# EasyEDA schematic SCH_Pico-Greenhouse-PCB_2026-05-26(1).json
TITLE: Greenhouse-Pico; REV: 2.2; Date: 2026-05-22; Sheet: 1/1; Drawn By: hiroyugane
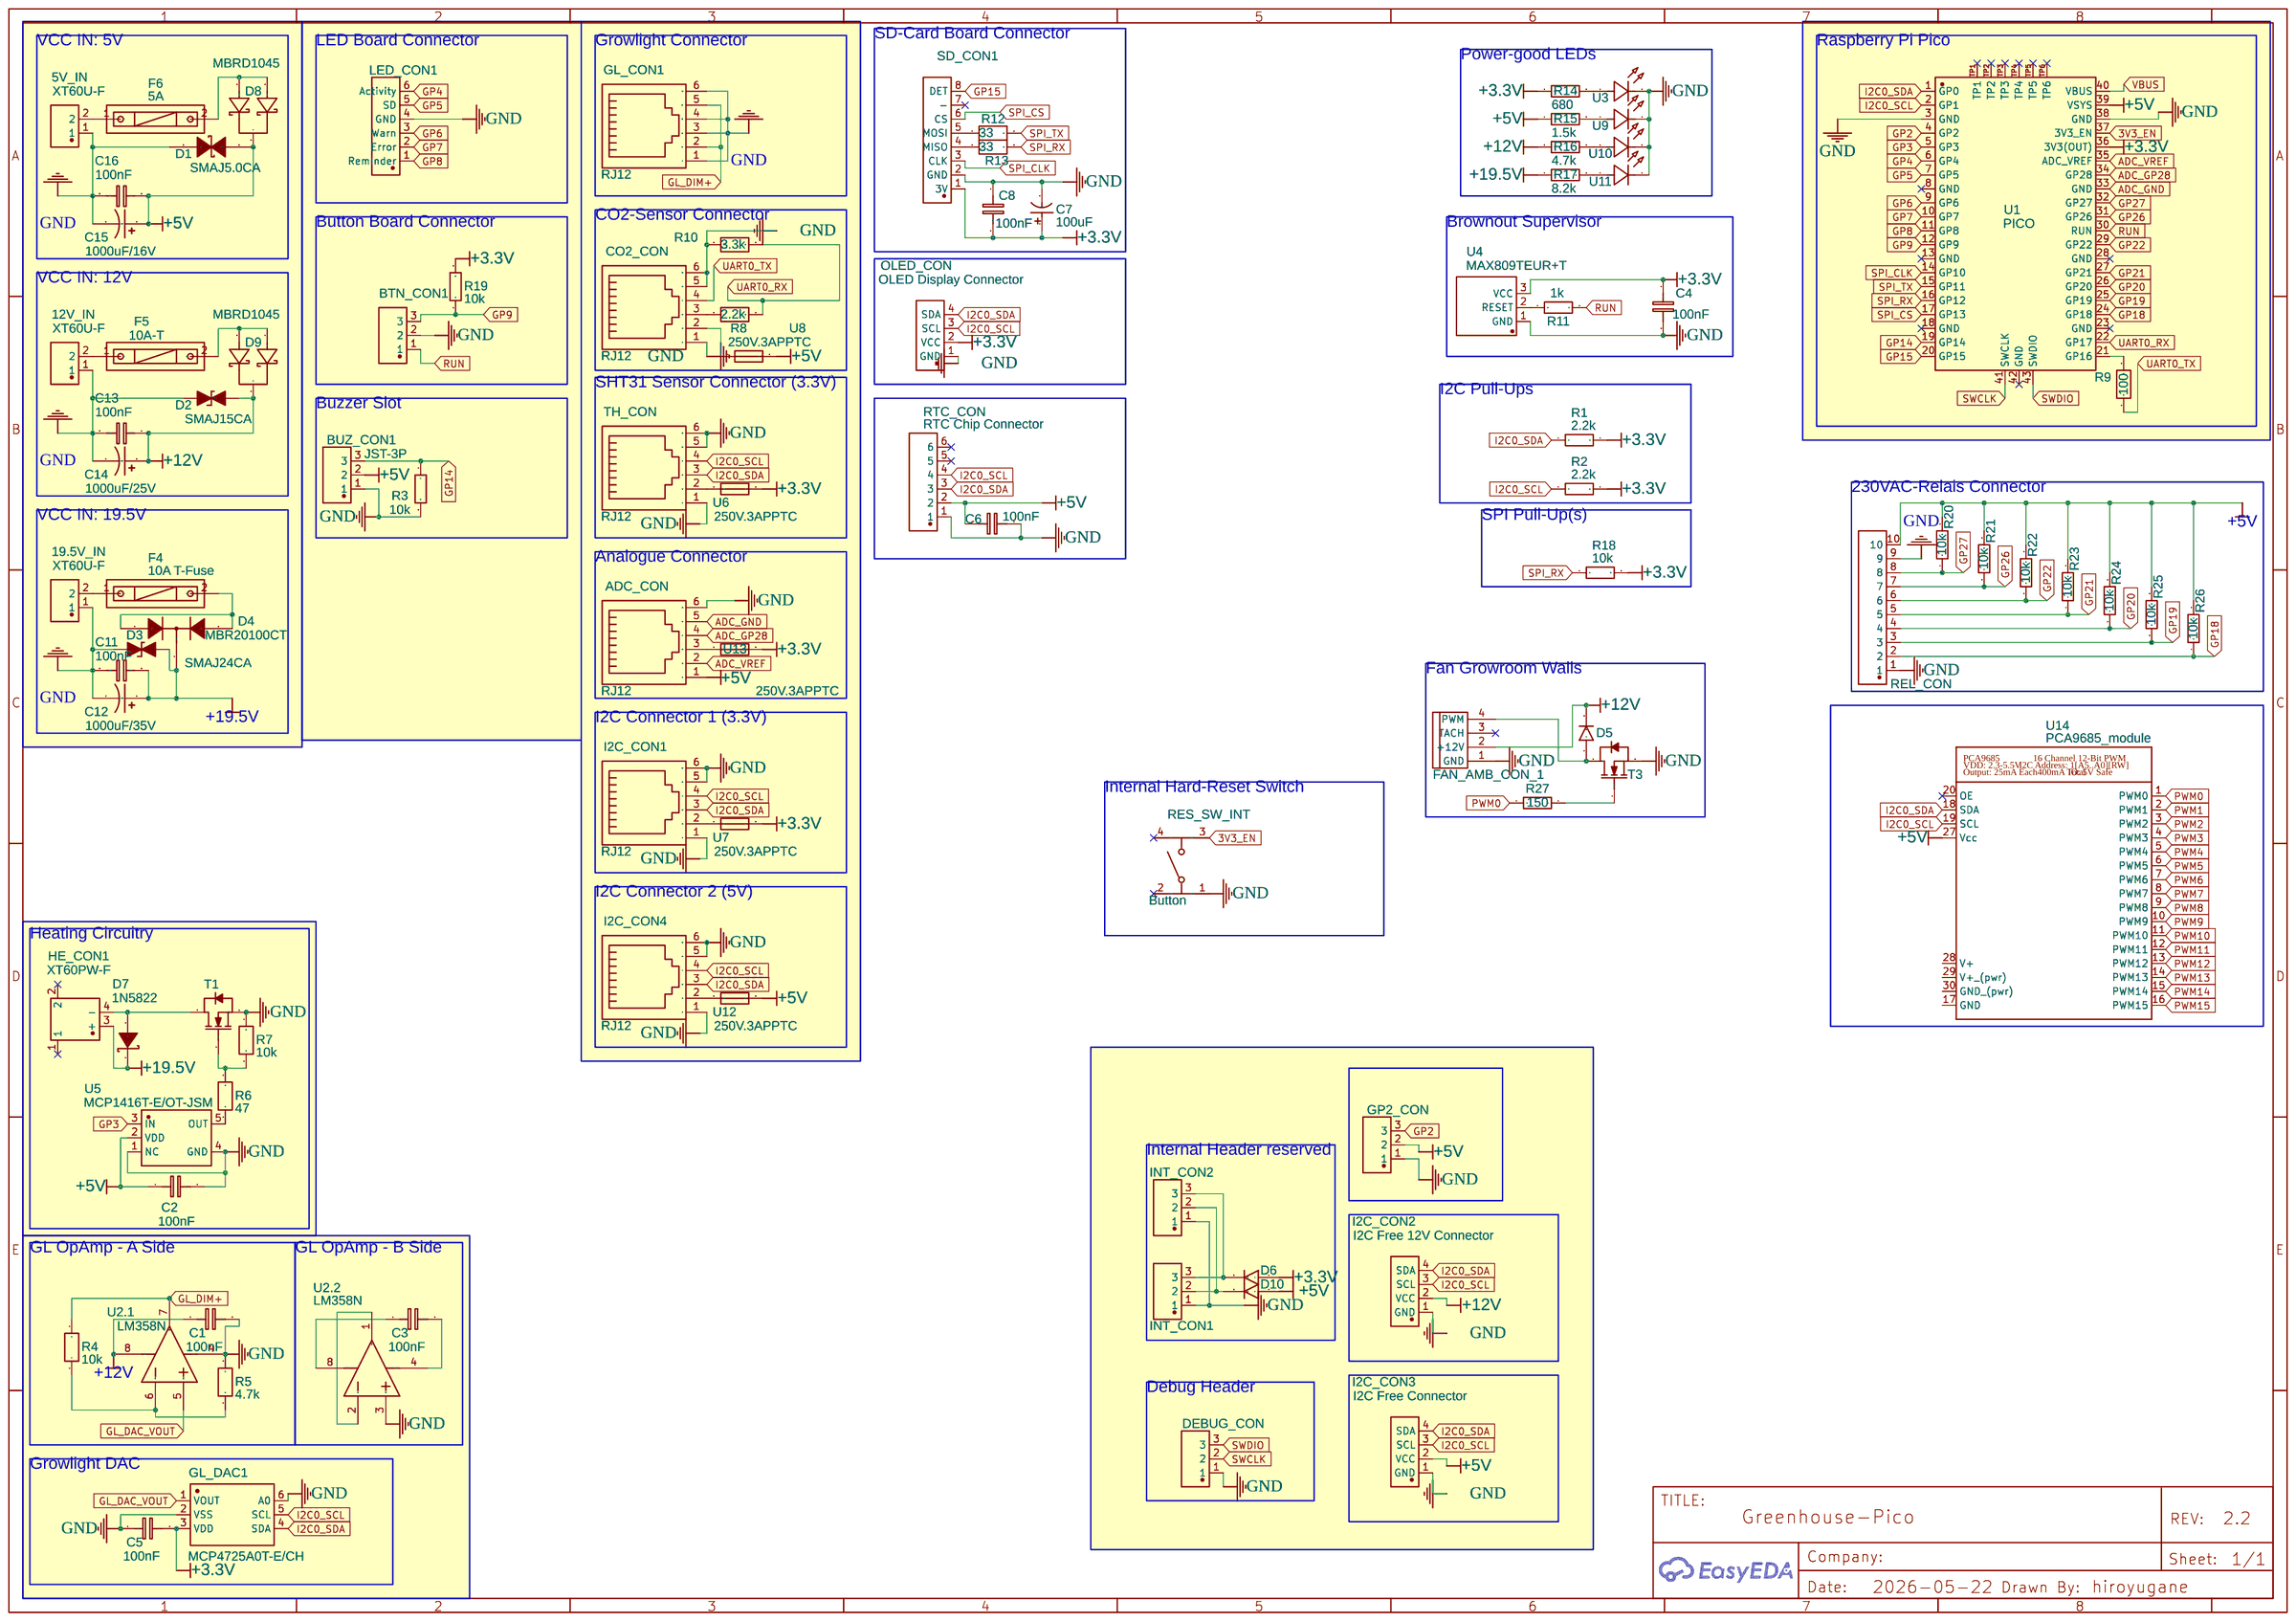
[diagram p0: schematic sheet]

## Parts
5V_IN  XT60U-F  [CONN-TH_XT60U-F]
12V_IN  XT60U-F  [CONN-TH_XT60U-F]
19.5V_IN  XT60U-F  [CONN-TH_XT60U-F]
ADC_CON  RJ12  [RJ12-TH_95501-2661]
BTN_CON1  Reset / Menu Button  [BUZ_CON]
BUZ_CON1  JST-3P  [BUZ_CON]
C1  100nF  [CONDENSATOR-SMALL]
C2  100nF  [CONDENSATOR-SMALL]
C3  100nF  [CONDENSATOR-SMALL]
C4  100nF  [CONDENSATOR-SMALL]
C5  100nF  [CONDENSATOR-SMALL]
C6  100nF  [CONDENSATOR-SMALL]
C7  100uF  [CAP-TH_BD5.0-P2.00-D0.8-FD]
C8  100nF  [CONDENSATOR-SMALL]
C11  100nF  [CONDENSATOR-SMALL]
C12  1000uF/35V  [CAP-TH_BD12.5-P5.00-D0.8-FD]
C13  100nF  [CONDENSATOR-SMALL]
C14  1000uF/25V  [CAP-TH_BD12.5-P5.00-D0.8-FD]
C15  1000uF/16V  [CAP-TH_BD12.5-P5.00-D0.8-FD]
C16  100nF  [CONDENSATOR-SMALL]
CO2_CON  RJ12  [RJ12-TH_95501-2661]
D1  SMAJ5.0CA  [SMA_L4.4-W2.6-LS5.0-BI]
D2  SMAJ15CA  [SMA_L4.4-W2.6-LS5.0-BI]
D3  SMAJ24CA  [SMA_L4.4-W2.6-LS5.0-BI]
D4  MBR20100CT  [TO-220-3_L10.0-W4.5-P2.54-L]
D5  UF4007_C84067  [DO-41_BD2.4-L4.7-P8.70-D0.9-FD]
D6  UF4007_C84067  [DO-41_BD2.4-L4.7-P8.70-D0.9-FD]
D7  1N5822  [DO-201AD_BD5.3-L8.4-P12.50-D1.4-FD]
D8  MBRD1045  [TO-252-3_L6.5-W5.9-P4.60-LS10.0-BL]
D9  MBRD1045  [TO-252-3_L6.5-W5.9-P4.60-LS10.0-BL]
D10  UF4007_C84067  [DO-41_BD2.4-L4.7-P8.70-D0.9-FD]
DEBUG_CON  B3B-XH-A-BK(LF)(SN)  [CONN-TH_3P-P2.50_B3B-XH-A-BK-LF-SN]
F4  10A T-Fuse  [FUSE-TH_L22.6-W9.0]
F5  10A-T  [FUSE-TH_L22.6-W9.0]
F6  5A  [FUSE-TH_L22.6-W9.0]
FAN_AMB_CON_1  XH2.54-4AW  [CONN-TH_XH2.54-4AW]
GL_CON1  RJ12  [RJ12-TH_95501-2661]
GL_DAC1  MCP4725A0T-E/CH  [SOT-23-6_L2.9-W1.6-P0.95-LS2.8-BL]
GP2_CON  GP2 Reserved  [CONN-TH_3P-P2.50_B3B-XH-A-BK-LF-SN]
HE_CON1  XT60PW-F  [TH_2P-XT60PW-F]
I2C_CON1  RJ12  [RJ12-TH_95501-2661]
I2C_CON2  I2C Free 12V Connector  [CONN-TH_4P-P2.50_JST_B4B-XH-A-M]
I2C_CON3  I2C Free Connector  [CONN-TH_4P-P2.50_JST_B4B-XH-A-M]
I2C_CON4  RJ12  [RJ12-TH_95501-2661]
INT_CON1  GP2 Reserved  [CONN-TH_3P-P2.50_B3B-XH-A-BK-LF-SN]
INT_CON2  GP2 Reserved  [CONN-TH_3P-P2.50_B3B-XH-A-BK-LF-SN]
LED_CON1  Led-PCB-Connector  [CONN-TH_6P-P2.50_JST_B6B-EH-LF-SN]
OLED_CON  OLED Display Connector  [CONN-TH_4P-P2.50_JST_B4B-XH-A-M]
R1  2.2k  [RES-TH_BD2.3-L6.5-P6.9-D0.5]
R2  2.2k  [RES-TH_BD2.3-L6.5-P6.9-D0.5]
R3  10k  [RES-TH_BD2.3-L6.5-P6.9-D0.5]
R4  10k  [R_TH]
R5  4.7k  [R_TH]
R6  47  [R_TH]
R7  10k  [R_TH]
R8  2.2k  [R_TH]
R9  100  [R_TH]
R10  3.3k  [R_TH]
R11  1k  [RES-TH_BD2.3-L6.5-P6.9-D0.5]
R12  33  [R_TH]
R13  33  [R_TH]
R14  680  [RES-TH_BD2.3-L6.5-P6.9-D0.5]
R15  1.5k  [RES-TH_BD2.3-L6.5-P6.9-D0.5]
R16  4.7k  [RES-TH_BD2.3-L6.5-P6.9-D0.5]
R17  8.2k  [RES-TH_BD2.3-L6.5-P6.9-D0.5]
R18  10k  [RES-TH_BD2.3-L6.5-P6.9-D0.5]
R19  10k  [RES-TH_BD2.3-L6.5-P6.9-D0.5]
R20  10k  [RES-TH_BD2.3-L6.5-P6.9-D0.5]
R21  10k  [RES-TH_BD2.3-L6.5-P6.9-D0.5]
R22  10k  [RES-TH_BD2.3-L6.5-P6.9-D0.5]
R23  10k  [RES-TH_BD2.3-L6.5-P6.9-D0.5]
R24  10k  [RES-TH_BD2.3-L6.5-P6.9-D0.5]
R25  10k  [RES-TH_BD2.3-L6.5-P6.9-D0.5]
R26  10k  [RES-TH_BD2.3-L6.5-P6.9-D0.5]
R27  150  [RES-TH_BD2.3-L6.5-P6.9-D0.5]
REL_CON  CONN-TH-10P  [CONN-TH_10P-P2.50_JST_B10B-EH]
RES_SW_INT  Button  [SW-TH_4P-L6.0-W6.0-P4.50-LS6.1]
RTC_CON  RTC Chip Connector  [RTC-CHIP FOOTPRINT]
SD_CON1  Adafruit SD Con  [CONN-TH_8P-P2.50-XH2.54-8P]
T1  IRLZ44NPBF-VB  [TO-220-3_L10.0-W4.5-P2.54-L-2]
T3  IRLZ44NPBF-VB  [TO-220-3_L10.0-W4.5-P2.54-L-2]
TH_CON  RJ12  [RJ12-TH_95501-2661]
U1  PICO  [RPI-PICO-V2]
U2  LM358N  [PDIP-8_L10.2-W5.9-P2.54-LS7.6-BL]  (sections 1,2)
U3  3RC  [LED-TH_BD3.0-2P-P2.50]
U4  MAX809TEUR+T  [SOT-23-3_L2.9-W1.6-P1.90-LS2.8-BR]
U5  MCP1416T-E/OT-JSM  [SOT-23-5_L3.0-W1.6-P0.95-LS2.8-BR]
U6  250V.3APPTC  [FUSE-TH_L11.4-W3.0-P5.10-D0.8-S1.20]
U7  250V.3APPTC  [FUSE-TH_L11.4-W3.0-P5.10-D0.8-S1.20]
U8  250V.3APPTC  [FUSE-TH_L11.4-W3.0-P5.10-D0.8-S1.20]
U9  3RC  [LED-TH_BD3.0-2P-P2.50]
U10  3RC  [LED-TH_BD3.0-2P-P2.50]
U11  3RC  [LED-TH_BD3.0-2P-P2.50]
U12  250V.3APPTC  [FUSE-TH_L11.4-W3.0-P5.10-D0.8-S1.20]
U13  250V.3APPTC  [FUSE-TH_L11.4-W3.0-P5.10-D0.8-S1.20]
U14  PCA9685_module  [PCA9685]

## Library data of the parts
5V_IN 12V_IN 19.5V_IN = XT60U-F: Supplier: LCSC; Supplier Part: C19191801; Manufacturer: AMASS(艾迈斯); JLCPCB Part Class: Extended Part; Contributor: lcsc
ADC_CON CO2_CON GL_CON1 I2C_CON1 I2C_CON4 TH_CON = 95501-2661: Contributor: LCSC; Supplier: LCSC; Supplier Part: C240856; Manufacturer: MOLEX; Manufacturer Part: 955012661; JLCPCB Part Class: Extended Part
BTN_CON1 BUZ_CON1 DEBUG_CON GP2_CON INT_CON1 INT_CON2 = B3B-XH-A-BK(LF)(SN): Contributor: LCSC; Supplier: LCSC; Supplier Part: C493416; Manufacturer: JST; JLCPCB Part Class: Extended Part
C1-C6 C8 C11 C13 C16 = C_0603_EU: Contributor: LCEDA_Lib
C7 = 100uf/10V: Supplier: LCSC; Manufacturer: Chengx(承兴); Manufacturer Part: KM107M010D11RR0VH2FP0; Supplier Part: C2035; JLCPCB Part Class: Extended Part
C12 C14 C15 = 50ZLJ1000M12.5X30: Contributor: lcsc; Supplier: LCSC; Supplier Part: C5115376; Manufacturer: rubycon(红宝石)
D1 = SMAJ5.0CA_C143136: Contributor: LCSC; Supplier Part: C143136; Supplier: LCSC; Manufacturer: FMS(美丽微); JLCPCB Part Class: Extended Part
D2 = SMAJ15CA: Supplier: LCSC; Manufacturer: RUILON(瑞隆源); Supplier Part: C46985; JLCPCB Part Class: Extended Part
D3 = SMAJ24CA: Supplier: LCSC; Manufacturer: RUILON(瑞隆源); Supplier Part: C28092; JLCPCB Part Class: Extended Part
D4 = MBR20100CT: Supplier: LCSC; Manufacturer: CJ(江苏长电/长晶); Supplier Part: C98706; JLCPCB Part Class: Extended Part
D5 D6 D10 = UF4007_C84067: Contributor: 立创EDA官方封装库; Supplier: LCSC; Manufacturer: 星海; Manufacturer Part: UF4007; Supplier Part: C84067; JLCPCB Part Class: Extended Part
D7 = 1N5822: Supplier: LCSC; Manufacturer: MDD(辰达半导体); Supplier Part: C2476; JLCPCB Part Class: Extended Part
D8 D9 = MBRD1045: Supplier: LCSC; Supplier Part: C5137764; Manufacturer: GOODWORK(固得沃克); JLCPCB Part Class: Extended Part; Contributor: lcsc
F4-F6 = 5x20 BLX-Atype Fuse holder XC-7: Supplier: LCSC; Manufacturer Part: 5x20 BLX-A型 保险丝支架 XC-7; Manufacturer: xcfuse(旭程); Supplier Part: C3131; JLCPCB Part Class: Extended Part
FAN_AMB_CON_1 = XH2.54-4AW: Supplier: LCSC; Manufacturer: BOOMELE(博穆精密); Manufacturer Part: XH-4AW; Supplier Part: C21273; JLCPCB Part Class: Extended Part
GL_DAC1 = MCP4725A0T-E/CH: Contributor: LCSC; Supplier: LCSC; Manufacturer: MICROCHIP(美国微芯); Supplier Part: C144198; JLCPCB Part Class: Extended Part
HE_CON1 = XT60PW-F_C428722: Supplier: LCSC; Supplier Part: C428722; Manufacturer: AMASS(艾迈斯); JLCPCB Part Class: Extended Part; Contributor: lcsc
I2C_CON2 I2C_CON3 OLED_CON = B4B-XH-A-R(LF)(SN): Contributor: lcsc; Supplier: LCSC; Supplier Part: C595709; Manufacturer: JST; JLCPCB Part Class: Extended Part
LED_CON1 = B6B-EH(LF)(SN): Contributor: LCSC; Supplier: LCSC; Supplier Part: C493147; Manufacturer: JST; JLCPCB Part Class: Extended Part
R1-R3 R11 R14-R27 = 330Ω (331) ±5%: Contributor: LCSC; Supplier: LCSC; Supplier Part: C10322; Manufacturer: Made in China; JLCPCB Part Class: Extended Part
R4-R10 R12 R13 = R_0603_EU: Contributor: LCEDA_Lib
REL_CON = B10B-EH(LF)(SN): Contributor: lcsc; Supplier: LCSC; Supplier Part: C265062; Manufacturer: JST; JLCPCB Part Class: Extended Part
RES_SW_INT = Button-6x6x6mm: Supplier Part: C71836; Supplier: LCSC; Manufacturer: BBJ; Manufacturer Part: Switch,6*6*6Plastic head,260G, 0.25mm,Straight line
RTC_CON = ZX-PM2.54-1-6PY: Supplier: LCSC; Supplier Part: C7499326; Manufacturer: Megastar(兆星); Contributor: lcsc; JLCPCB Part Class: Extended Part
SD_CON1 = HDGC2501WV-8P: Supplier: LCSC; Supplier Part: C5175254; Manufacturer: HDGC(华德共创); JLCPCB Part Class: Extended Part; Contributor: lcsc
T1 T3 = IRLZ44NPBF-VB: Supplier: LCSC; Supplier Part: C20755022; Manufacturer: VBsemi(微碧半导体); JLCPCB Part Class: Extended Part; Contributor: lcsc
U1 = PICO: Supplier: LCSC; Supplier Part: C7203002; Manufacturer: Raspberry Pi(树莓派); Contributor: lcsc; JLCPCB Part Class: Extended Part
U2 = LM358N: subpart_no: 1; Supplier: LCSC; Supplier Part: C83405; Manufacturer: TI(德州仪器); Manufacturer Part: LM358N/NOPB; JLCPCB Part Class: Extended Part
U3 U9-U11 = 3RC: Supplier: LCSC; Supplier Part: C19479802; Manufacturer: BIVAR; JLCPCB Part Class: Extended Part; Contributor: lcsc
U4 = MAX809TEUR+T: Supplier: LCSC; Manufacturer: ADI(亚德诺)/MAXIM(美信); Supplier Part: C16711; JLCPCB Part Class: Extended Part
U5 = MCP1416T-E/OT-JSM: Supplier: LCSC; Supplier Part: C18195002; Manufacturer: JSMSEMI(杰盛微); Contributor: lcsc; JLCPCB Part Class: Extended Part
U6-U8 U12 U13 = 30V3APPTC: Contributor: lcsc; Supplier: LCSC; Supplier Part: C9900014925; Manufacturer: null; JLCPCB Part Class: Extended Part
U14 = PCA9685_module: Contributor: Quentin Chatenet

## Nets
3V3_EN: RES_SW_INT.3 U1.37(3V3_EN)
+3.3V: C4.1 C5.2 C7.1 C8.2 D6.1(A) GL_DAC1.3(VDD) OLED_CON.2(VCC) R1.2 R2.2 R14.1 R18.2 R19.2 SD_CON1.1(3V) U1.36(3V3(OUT)) U4.3(VCC) U6.2 U7.2 U13.2
+5V: ADC_CON.1 BUZ_CON1.2 C2.1 C6.1 C15.1 C16.1 D1.1 D8.2(K) D10.1(A) GP2_CON.2 I2C_CON3.2(VCC) R15.1 R20.2 R21.2 R22.2 R23.2 R24.2 R25.2 R26.2 REL_CON.10 RTC_CON.2 U1.39(VSYS) U5.2(VDD) U8.2 U12.2 U14.27(Vcc)
+12V: C1.1 C13.1 C14.1 D2.1(K) D5.2(C) D9.2(K) FAN_AMB_CON_1.2(+12V) I2C_CON2.2(VCC) R16.1
+19.5V: C11.1 C12.1 D3.1(K) D4.2(C) D7.2(K) HE_CON1.3(+) R17.1
GND: 5V_IN.1 12V_IN.1 19.5V_IN.1 ADC_CON.6 BTN_CON1.2 BUZ_CON1.1 C1.2 C2.2 C4.2 C5.1 C6.2 C7.2 C8.1 C11.2 C12.2 C13.2 C14.2 C15.2 C16.2 CO2_CON.1 CO2_CON.5 CO2_CON.6 D1.2 D2.2(A) D3.2(A) DEBUG_CON.1 FAN_AMB_CON_1.1(GND) GL_CON1.1 GL_CON1.3(GL-) GL_CON1.4(GL-) GL_CON1.6 GL_DAC1.2(VSS) GL_DAC1.6(A0) GP2_CON.1 I2C_CON1.1 I2C_CON1.5 I2C_CON1.6 I2C_CON2.1(GND) I2C_CON3.1(GND) I2C_CON4.1 I2C_CON4.5 I2C_CON4.6 INT_CON1.1 INT_CON2.1 LED_CON1.4(GND) OLED_CON.1(GND) R3.2 R5.2 R7.1 R10.1 REL_CON.1 REL_CON.9 RES_SW_INT.1 RTC_CON.1 SD_CON1.2(GND) T1.3(S) T3.3(S) TH_CON.1 TH_CON.5 TH_CON.6 U1.3(GND) U1.38(GND) U2.3(+IN 1) U3.2(K) U4.1(GND) U5.1(NC) U5.4(GND) U9.2(K) U10.2(K) U11.2(K)
VBUS: U1.40(VBUS)
ADC_GND: ADC_CON.5 U1.33(GND)
ADC_GP28: ADC_CON.4 U1.34(GP28)
ADC_VREF: ADC_CON.2 U1.35(ADC_VREF)
GL_DAC_VOUT: GL_DAC1.1(VOUT) U2.5(+IN 2)
GL_DIM+: GL_CON1.2(GL+) GL_CON1.5(GL+) R4.2 U2.7(OUT 2)
GP2: GP2_CON.3 U1.4(GP2)
GP3: U1.5(GP3) U5.3(IN)
GP4: LED_CON1.6(Activity) U1.6(GP4)
GP5: LED_CON1.5(SD) U1.7(GP5)
GP6: LED_CON1.3(Warn) U1.9(GP6)
GP7: LED_CON1.2(Error) U1.10(GP7)
GP8: LED_CON1.1(Reminder) U1.11(GP8)
GP9: BTN_CON1.3 R19.1 U1.12(GP9)
GP14: BUZ_CON1.3 R3.1 U1.19(GP14)
GP15: SD_CON1.8(DET) U1.20(GP15)
GP18: R26.1 REL_CON.2 U1.24(GP18)
GP19: R25.1 REL_CON.3 U1.25(GP19)
GP20: R24.1 REL_CON.4 U1.26(GP20)
GP21: R23.1 REL_CON.5 U1.27(GP21)
GP22: R22.1 REL_CON.6 U1.29(GP22)
GP26: R21.1 REL_CON.7 U1.31(GP26)
GP27: R20.1 REL_CON.8 U1.32(GP27)
I2C0_SCL: GL_DAC1.5(SCL) I2C_CON1.4 I2C_CON2.3(SCL) I2C_CON3.3(SCL) I2C_CON4.4 OLED_CON.3(SCL) R2.1 RTC_CON.4 TH_CON.4 U1.2(GP1) U14.19(SCL)
I2C0_SDA: GL_DAC1.4(SDA) I2C_CON1.3 I2C_CON2.4(SDA) I2C_CON3.4(SDA) I2C_CON4.3 OLED_CON.4(SDA) R1.1 RTC_CON.3 TH_CON.3 U1.1(GP0) U14.18(SDA)
PWM0: R27.2 U14.1(PWM0)
PWM1: U14.2(PWM1)
PWM2: U14.3(PWM2)
PWM3: U14.4(PWM3)
PWM4: U14.5(PWM4)
PWM5: U14.6(PWM5)
PWM6: U14.7(PWM6)
PWM7: U14.8(PWM7)
PWM8: U14.9(PWM8)
PWM9: U14.10(PWM9)
PWM10: U14.11(PWM10)
PWM11: U14.12(PWM11)
PWM12: U14.13(PWM12)
PWM13: U14.14(PWM13)
PWM14: U14.15(PWM14)
PWM15: U14.16(PWM15)
RUN: BTN_CON1.1 R11.2 U1.30(RUN)
SPI_CLK: SD_CON1.3(CLK) U1.14(GP10)
SPI_CS: SD_CON1.6(CS) U1.17(GP13)
SPI_RX: R13.2 R18.1 U1.16(GP12)
SPI_TX: R12.2 U1.15(GP11)
SWCLK: DEBUG_CON.2 U1.41(SWCLK)
SWDIO: DEBUG_CON.3 U1.43(SWDIO)
UART0_RX: R8.2 R10.2 U1.22(GP17)
UART0_TX: CO2_CON.4 R9.2
Net-(5V_IN-2): 5V_IN.2 F6.1
Net-(12V_IN-2): 12V_IN.2 F5.1
Net-(19.5V_IN-2): 19.5V_IN.2 F4.1
Net-(ADC_CON-3): ADC_CON.3 U13.1
Net-(C3-1): C3.1 U2.8(+V)
Net-(C3-2): C3.2 U2.4(-V)
Net-(CO2_CON-2): CO2_CON.2 U8.1
Net-(CO2_CON-3): CO2_CON.3 R8.1
Net-(D4-1): D4.1(A) D4.3(A) F4.2
Net-(D5-1): D5.1(A) FAN_AMB_CON_1.4(PWM) T3.2(D)
Net-(D6-2): D6.2(C) INT_CON1.3 INT_CON2.3
Net-(D7-1): D7.1(A) HE_CON1.4(-) T1.2(D)
Net-(D8-1): D8.1(A) D8.3(A) F6.2
Net-(D9-1): D9.1(A) D9.3(A) F5.2
Net-(D10-2): D10.2(C) INT_CON1.2 INT_CON2.2
Net-(I2C_CON1-2): I2C_CON1.2 U7.1
Net-(I2C_CON4-2): I2C_CON4.2 U12.1
Net-(R4-1): R4.1 R5.1 U2.6(-IN 2)
Net-(R6-1): R6.1 U5.5(OUT)
Net-(R6-2): R6.2 R7.2 T1.1(G)
Net-(R9-1): R9.1 U1.21(GP16)
Net-(R11-1): R11.1 U4.2(RESET)
Net-(R12-1): R12.1 SD_CON1.5(MOSI)
Net-(R13-1): R13.1 SD_CON1.4(MISO)
Net-(R14-2): R14.2 U3.1(A)
Net-(R15-2): R15.2 U9.1(A)
Net-(R16-2): R16.2 U10.1(A)
Net-(R17-2): R17.2 U11.1(A)
Net-(R27-1): R27.1 T3.1(G)
Net-(TH_CON-2): TH_CON.2 U6.1
Net-(U2.2-1): U2.1(OUT 1) U2.2(-IN 1)

Not connected (* = marked no-connect by the designer): FAN_AMB_CON_1 3(TACH)*; HE_CON1 1* 2*; RES_SW_INT 2* 4*; RTC_CON 5* 6*; SD_CON1 7(-)*; U1 8(GND)* 13(GND)* 18(GND)* 23(GND)* 28(GND)* 42(GND)* TP1* TP2* TP3* TP4* TP5* TP6*; U14 17(GND) 20(OE)* 28(V+) 29(V+ (pwr)) 30(GND (pwr))

## Notes on the sheet
- SD-Card Board Connector
- VCC IN: 5V
- LED Board Connector
- Growlight Connector
- Raspberry Pi Pico
- Power-good LEDs
- CO2-Sensor Connector
- Button Board Connector
- Brownout Supervisor
- VCC IN: 12V
- SHT31 Sensor Connector (3.3V)
- I2C Pull-Ups
- Buzzer Slot
- 230VAC-Relais Connector
- VCC IN: 19.5V
- SPI Pull-Up(s)
- Analogue Connector
- Fan Growroom Walls
- I2C Connector 1 (3.3V)
- Internal Hard-Reset Switch
- I2C Connector 2 (5V)
- Heating Circuitry
- Internal Header reserved
- GL OpAmp - A Side
- GL OpAmp - B Side
- Debug Header
- Growlight DAC
